# EAGLE design Part_Ninja_V1 (EAGLE 5.11)
PROJECT: Part Ninja
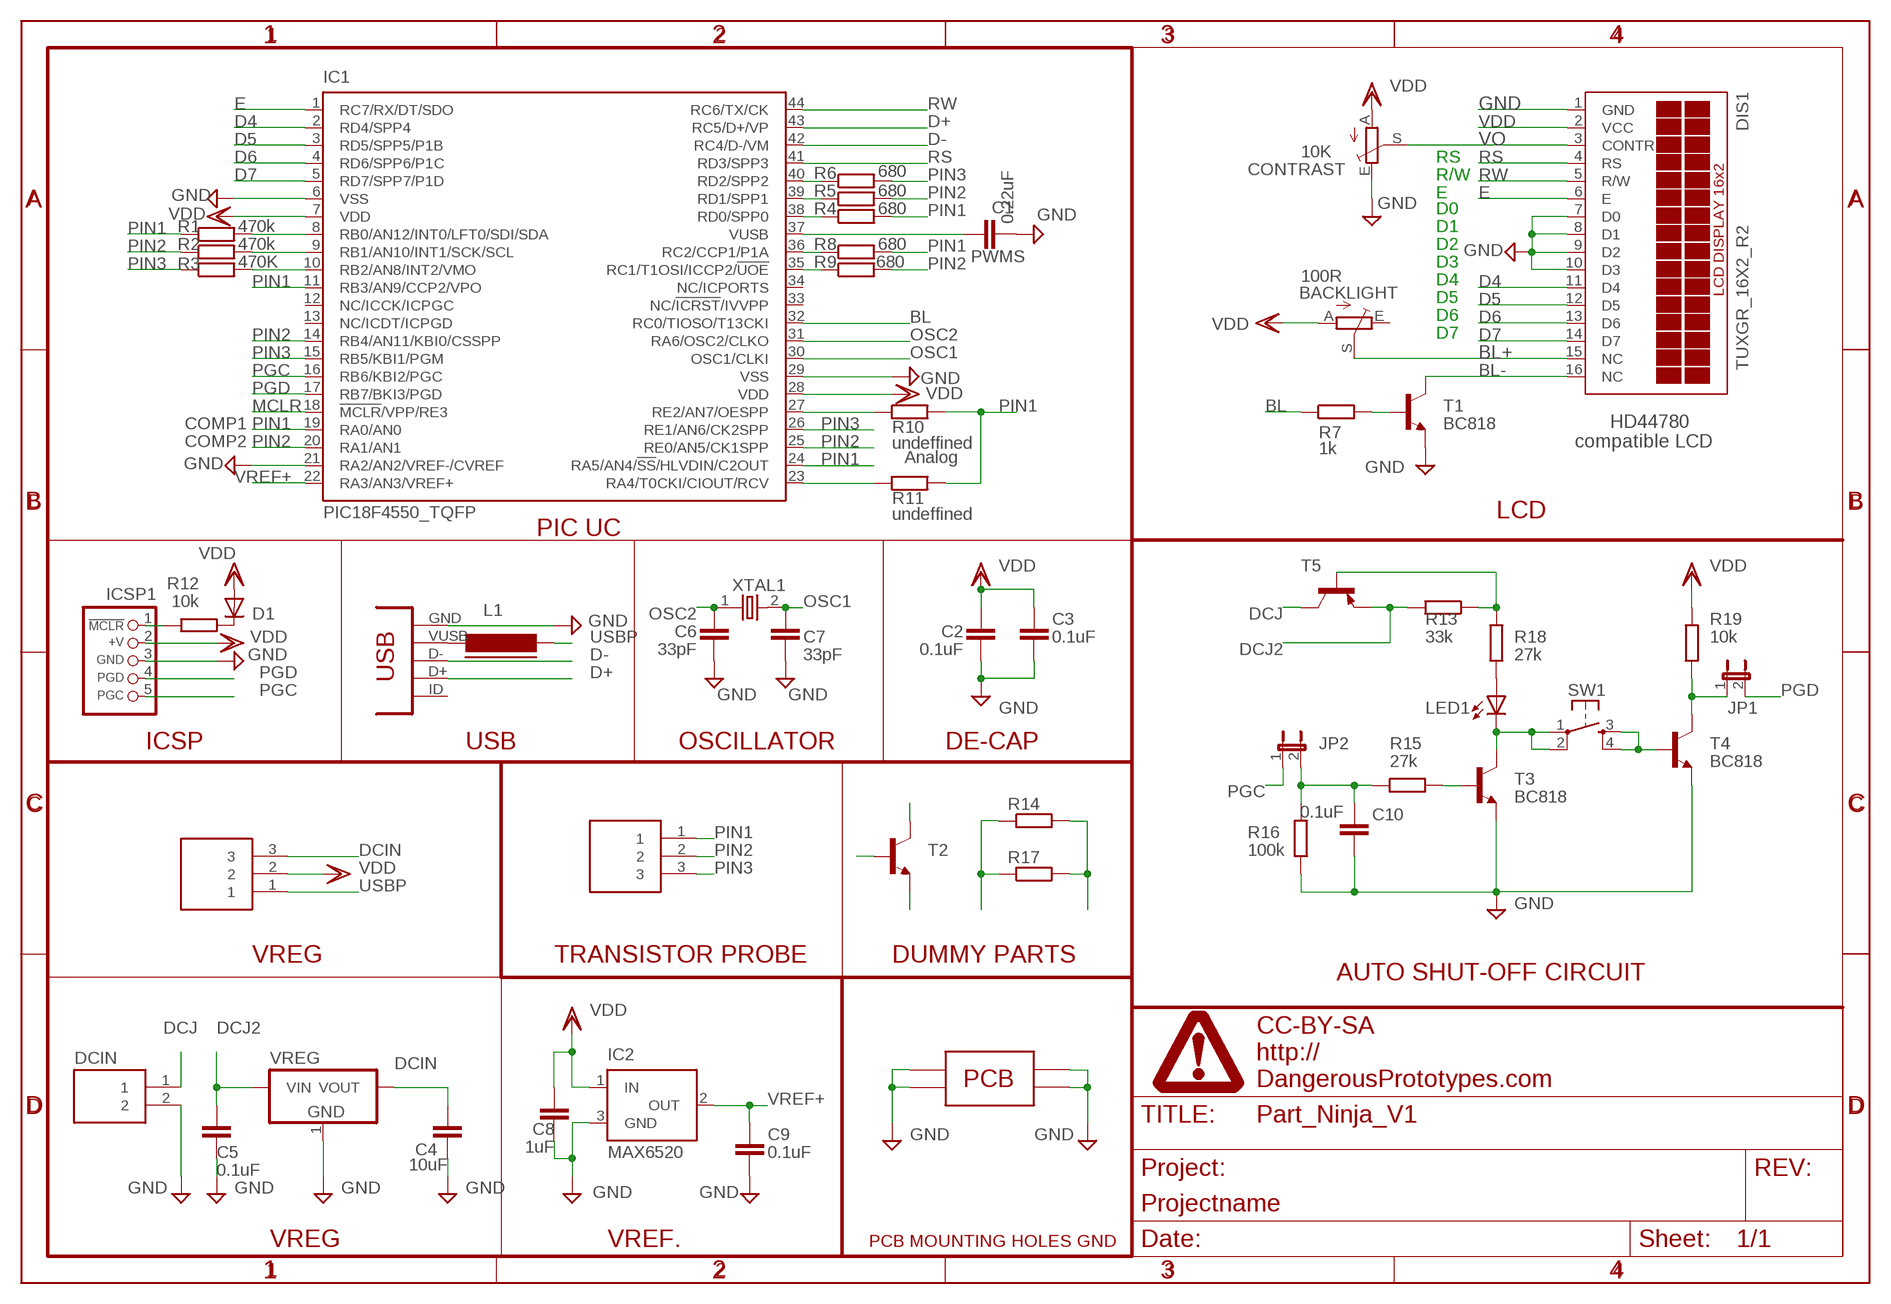
[diagram p0: schematic, sheet 1]

## Parts
BACKLIGHT  100R  TRIM_EU-B25P  [B25P]
C1  0.22uF  CAPC603  [C603]
C2  0.1uF  CAPC603  [C603]
C3  0.1uF  CAPC603  [C603]
C4  10uF  CAPC603  [C603]
C5  0.1uF  CAPC603  [C603]
C6  33pF  CAPC603  [C603]
C7  33pF  CAPC603  [C603]
C8  1uF  CAPC603  [C603]
C9  0.1uF  CAPC603  [C603]
C10  0.1uF  CAPC603  [C603]
CONTRAST  10K  TRIM_EU-B25P  [B25P]
D1  D-SOD123  [SOD123]
DCIN  HEADER1X2PTH  [M1X2]
DIS1  TUXGR_16X2_R2  [TUXGR_16X2_R2]
IC1  PIC18F4550_TQFP  [TQFP44]
IC2  MAX6520  [SOT23]
ICSP1  HEADER_PRG_PIC_ICSPB  [HEADER_PRG_1X05_ICSP_B]
JP1  JP1E  [JP1]
JP2  JP1E  [JP1]
L1  FERRITE_BEAD603  [FB603]
LED1  LED805  [LED-805]
PROBES  HEADER1X3PTH  [M1X3]
PWR  HEADER1X3PTH  [M1X3]
R1  470k  RESISTORR603  [R603]
R2  470k  RESISTORR603  [R603]
R3  470K  RESISTORR603  [R603]
R4  680  RESISTORR603  [R603]
R5  680  RESISTORR603  [R603]
R6  680  RESISTORR603  [R603]
R7  1k  RESISTORR603  [R603]
R8  680  RESISTORR603  [R603]
R9  680  RESISTORR603  [R603]
R10  undeffined  RESISTORR603  [R603]
R11  undeffined  RESISTORR603  [R603]
R12  10k  RESISTORR603  [R603]
R13  33k  RESISTORR603  [R603]
R14  RESISTORR1206  [R1206]
R15  27k  RESISTORR603  [R603]
R16  100k  RESISTORR603  [R603]
R17  RESISTORR603  [R603]
R18  27k  RESISTORR603  [R603]
R19  10k  RESISTORR603  [R603]
SW1  SW-SMD-SMALL  [TACT_SWITCH_SMALL]
T1  BC818  NPNSOT23BEC  [SOT23-BEC]
T2  BC818  NPNSOT23BEC  [SOT23-BEC]
T3  BC818  NPNSOT23BEC  [SOT23-BEC]
T4  BC818  NPNSOT23BEC  [SOT23-BEC]
T5  BJT-PNPSOT23BEC  [SOT23-BEC]
U$1  DINA4_L  [DP_LOGO]
U$2  PCB_STANDARD4.9X8  [PCB4.9X8]
USB1  CON-USB-MINI-BUSB1  [CONN_USB_MINI-B]
VREG  LD1117-3.3SOT223  [SOT223]
XTAL1  OSC-XTAL  [HC-49U]

## Nets
BL: IC1.32(RC0/TIOSO/T13CKI) R7.1
BL+: BACKLIGHT.S DIS1.15(NC)
BL-: DIS1.16(NC) T1.C
D4: DIS1.11(D4) IC1.2(RD4/SPP4)
D5: DIS1.12(D5) IC1.3(RD5/SPP5/P1B)
D6: DIS1.13(D6) IC1.4(RD6/SPP6/P1C)
D7: DIS1.14(D7) IC1.5(RD7/SPP7/P1D)
D+: IC1.43(RC5/D+/VP) USB1.D+
D-: IC1.42(RC4/D-/VM) USB1.D-
DCIN: C4.2 PWR.3 VREG.2(VOUT)
DCJ: DCIN.1 T5.C
DCJ2: C5.2 R13.2 T5.E VREG.3(VIN)
E: DIS1.6(E) IC1.1(RC7/RX/DT/SDO)
GND: C1.2 C2.1 C3.1 C4.1 C5.1 C6.1 C7.1 C8.1 C9.1 C10.1 CONTRAST.E DCIN.2 DIS1.1(GND) DIS1.7(D0) DIS1.8(D1) DIS1.9(D2) DIS1.10(D3) IC1.6(VSS) IC1.21(RA2/AN2/VREF-/CVREF) IC1.29(VSS) IC2.3(GND) ICSP1.3(GND) R16.1 T1.E T3.E T4.E U$2.P$1 U$2.P$2 U$2.P$3 U$2.P$4 USB1.GND VREG.1(GND)
MCLR: IC1.18(!MCLR!/VPP/RE3) ICSP1.1(/MCLR) R12.1
N$1: R7.2 T1.B
N$2: IC1.8(RB0/AN12/INT0/LFT0/SDI/SDA) R1.2
N$3: IC1.9(RB1/AN10/INT1/SCK/SCL) R2.2
N$4: IC1.10(RB2/AN8/INT2/VMO) R3.2
N$5: IC1.38(RD0/SPP0) R4.1
N$6: IC1.39(RD1/SPP1) R5.1
N$7: IC1.40(RD2/SPP2) R6.1
N$8: IC1.27(RE2/AN7/OESPP) R10.1
N$9: LED1.A R18.1
N$10: C1.1 IC1.37(VUSB)
N$11: IC1.23(RA4/T0CKI/CIOUT/RCV) R11.1
N$12: IC1.36(RC2/CCP1/P1A) R8.1
N$13: IC1.35(RC1/T1OSI/ICCP2/!UOE) R9.1
N$14: D1.1(C) R12.2
N$16: SW1.3 SW1.4 T4.B
N$17: R13.1 R18.2 T5.B
N$18: LED1.C SW1.1 SW1.2 T3.C
N$19: R15.2 T3.B
N$21: JP1.1 R19.1 T4.C
N$22: C10.2 JP2.2 R15.1 R16.2
N$23: L1.1 USB1.VUSB
OSC1: C7.2 IC1.30(OSC1/CLKI) XTAL1.2
OSC2: C6.2 IC1.31(RA6/OSC2/CLKO) XTAL1.1
PGC: IC1.16(RB6/KBI2/PGC) ICSP1.5(PGC) JP2.1
PGD: IC1.17(RB7/BKI3/PGD) ICSP1.4(PGD) JP1.2
PIN1: IC1.11(RB3/AN9/CCP2/VPO) IC1.19(RA0/AN0) IC1.24(RA5/AN4/!SS!/HLVDIN/C2OUT) PROBES.1 R1.1 R4.2 R8.2 R10.2 R11.2 R14.1 R17.1 T2.C
PIN2: IC1.14(RB4/AN11/KBI0/CSSPP) IC1.20(RA1/AN1) IC1.25(RE0/AN5/CK1SPP) PROBES.2 R2.1 R5.2 R9.2 R14.2 R17.2 T2.B
PIN3: IC1.15(RB5/KBI1/PGM) IC1.26(RE1/AN6/CK2SPP) PROBES.3 R3.1 R6.2 T2.E
RS: DIS1.4(RS) IC1.41(RD3/SPP3)
RW: DIS1.5(R/W) IC1.44(RC6/TX/CK)
USBP: L1.2 PWR.1
VDD: BACKLIGHT.A C2.2 C3.2 C8.2 CONTRAST.A D1.2(A) DIS1.2(VCC) IC1.7(VDD) IC1.28(VDD) IC2.1(IN) ICSP1.2(+V) PWR.2 R19.2
VO: CONTRAST.S DIS1.3(CONTR)
VREF+: C9.2 IC1.22(RA3/AN3/VREF+) IC2.2(OUT)
Unconnected: BACKLIGHT.E IC1.12(NC/ICCK/ICPGC) IC1.13(NC/ICDT/ICPGD) IC1.33(NC/!ICRST!/IVVPP) IC1.34(NC/ICPORTS) USB1.BODY@1(BODY) USB1.BODY@2(BODY) USB1.BODY@3(BODY) USB1.BODY@4(BODY) USB1.ID(USBID)

## Notes on the sheet
- RS
- R/W
- E
- D0
- D1
- PWMS | D2
- D3
- D4
- D5
- D6
- D7
- COMP1 | HD44780
- COMP2 | compatible LCD
- Analog
- LCD
- PIC UC
- ICSP | USB | OSCILLATOR | DE-CAP
- VREG | TRANSISTOR PROBE | DUMMY PARTS
- AUTO SHUT-OFF CIRCUIT
- VREG | VREF. | PCB MOUNTING HOLES GND

## Library data of the parts
BACKLIGHT CONTRAST = pot:TRIM_EU-: POTENTIOMETER
C1-C10 = dp_devices:CAP
D1 = semicon-smd-ipc:D-: DIODE unfilled
DCIN = dp_devices:HEADER1X2
DIS1 = display-lcd:TUXGR_16X2_R2: Tuxgraphics LCD display 16x2 characters reflective, without background light Source: tuxgr_12x2_r2.pdf; OC_FARNELL: unknown; OC_NEWARK: unknown
IC1 = microchip:PIC18F4*_TQFP: USB Microcontrollers with nanoWatt Technology High-Performance, Enhanced Flash, 28/40/44-Pin, Source: http://ww1.microchip.com/downloads/en/devicedoc/39632c.pdf; MF: MICROCHIP; MPN: PIC18F4550-I/PT; OC_FARNELL: 9321365; OC_NEWARK: 08J9633
IC2 = maxim:MAX6520: 1.2V Voltage Reference 50ppm/°C, SOT23, 3-Terminal Source: http://datasheets.maxim-ic.com/en/ds/MAX6520.pdf; MF: MAXIM; MPN: MAX6520EUR-T; OC_FARNELL: unknown; OC_NEWARK: 02J4586
ICSP1 = dp_devices:HEADER_PRG_PIC_ICSP: 5-pin PIC In Circuit Serial Programming header
JP1 JP2 = jumper:JP1E: JUMPER
L1 = dp_devices:FERRITE_BEAD
LED1 = DP2:LED
PROBES = DP2:HEADER1X3
PWR = dp_devices:HEADER1X3
R1-R13 R15 R16 R18 R19 = dp_devices:RESISTOR
R14 R17 = fifo:RESISTOR
SW1 = dp_devices:SW-SMD-SMALL
T1-T4 = dp_devices:NPN: Most commonly used is SOT23-BEC
T5 = DP2:BJT-PNP: Most commonly used is SOT23-BEC
U$1 = DP2:DINA4_L: A4 DP frame Standard Dangerous Prototypes schematic frame. Automagically adds the DP logo and standard texts to the PCB Use the atrribute in the schematic editor to change the fields.; FF1: fulfillment by; FF2: Seeed Studio; FF3: www.seeedstudio.com; LICENSE: CC-BY-SA; PROJECT: Projectname; URL1: http://; URL2: DangerousPrototypes.com
U$2 = DP2:PCB_STANDARD
USB1 = dp_devices:CON-USB-MINI-B: USB connector
VREG = dp_devices:LD1117-3.3
XTAL1 = dp_devices:OSC-XTAL

## Board
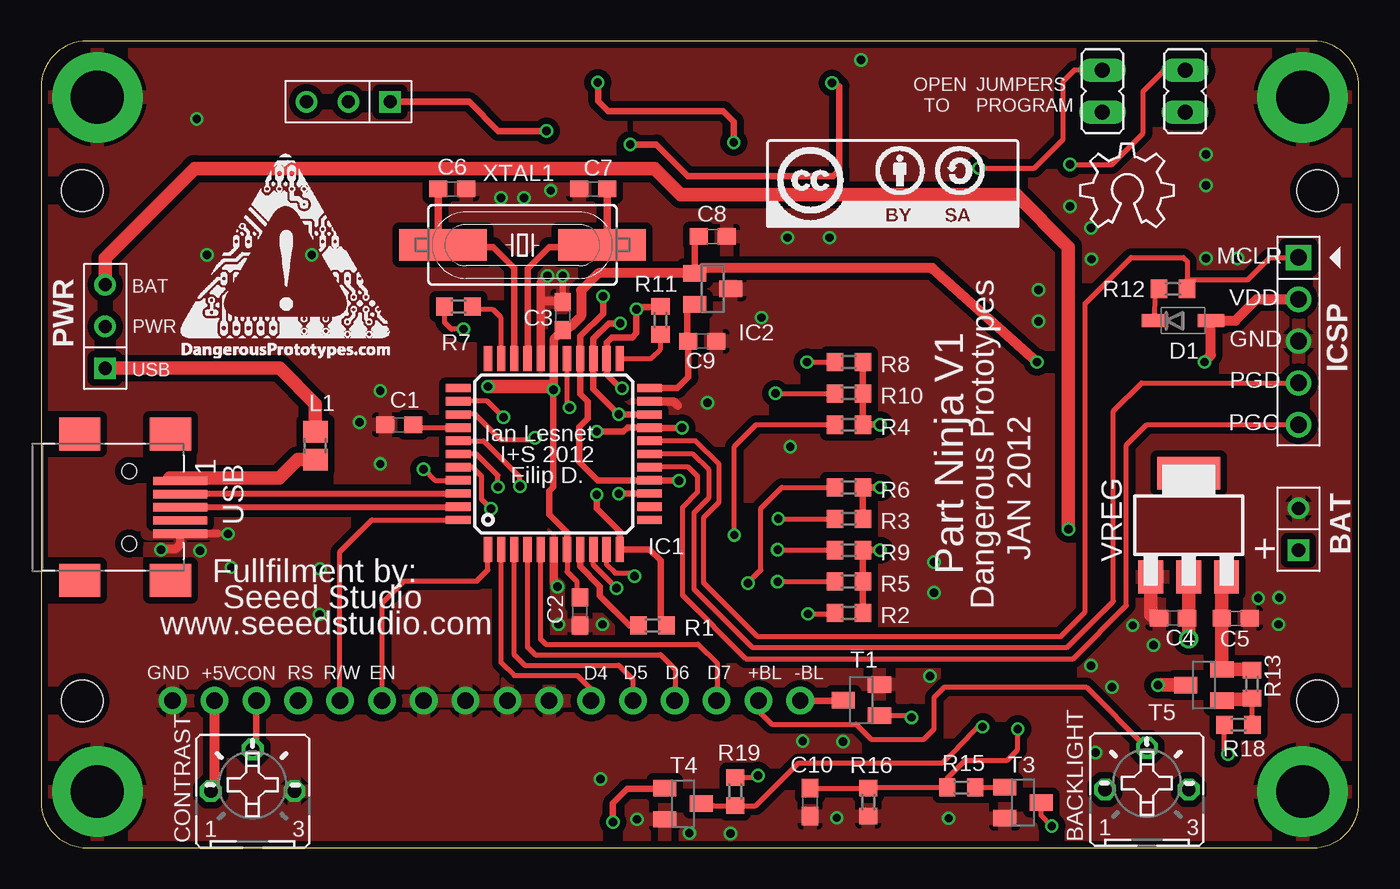
[diagram p1: board, top side]
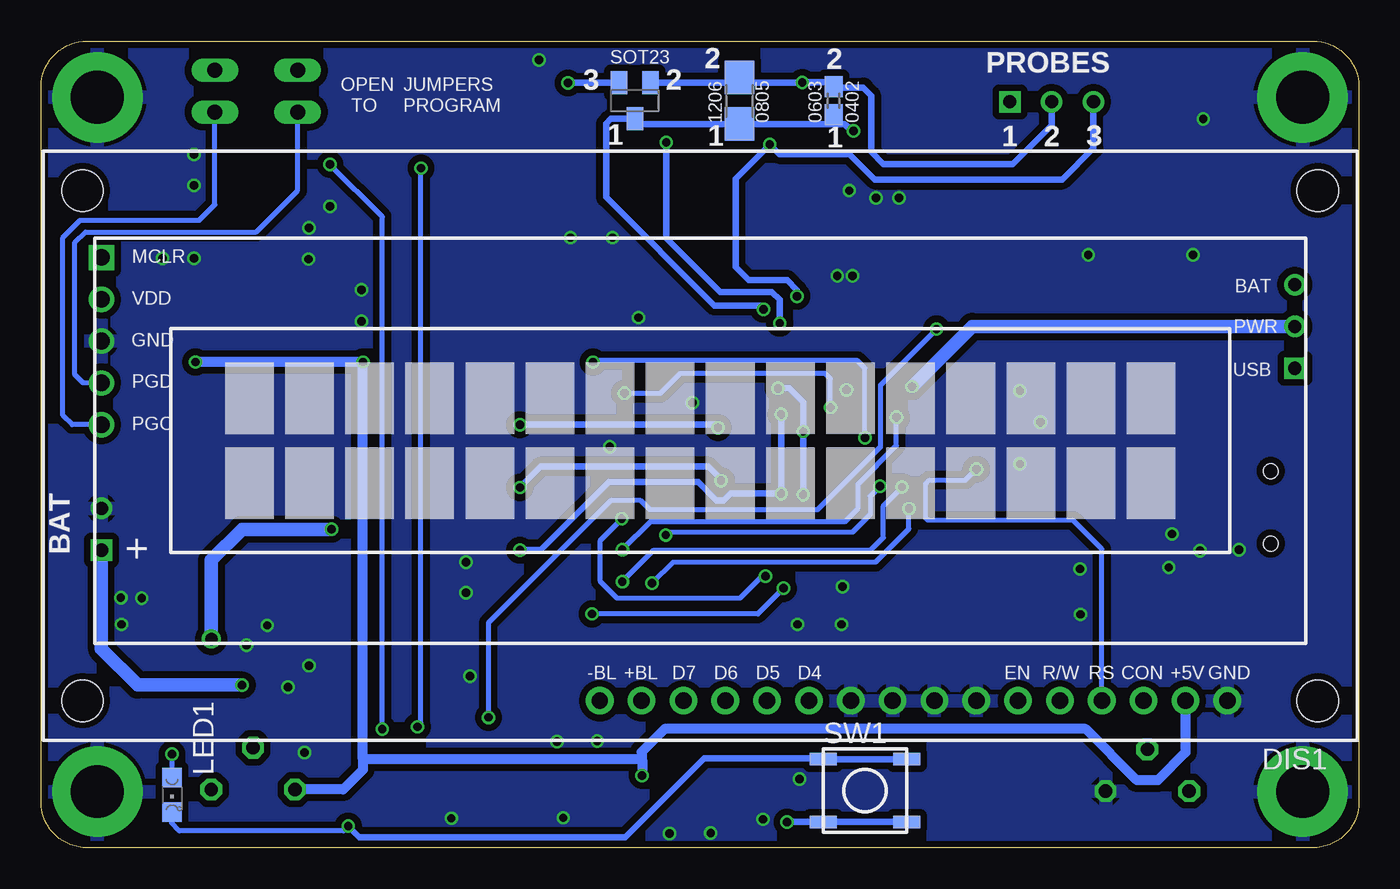
[diagram p2: board, bottom side, seen from below]

Size 80 x 49 mm. Coordinates in mm from the lower left corner, seen from the top.
Copper layers (1*16): Top 0.035mm / dielectric 1.5mm / Bottom 0.035mm
Design rules "Fusion_eagle_rule_v1.1": minimum track width 6mil, minimum drill 12mil, track to track 6mil, track to pad 6mil, pad to pad 6mil, via to via 6mil, smd to smd 0mil, copper to edge 10mil, drill to drill 10mil, minimum pad ring 10mil, minimum via ring 6mil, stop-mask expansion 2mil, vias tented up to drill 100mil, thermal gap 10mil

### Footprints (pad centres in the part's own frame; a part is rotated, then mirrored left to right if it is on the bottom)
B25P = drill 0.813 octagon: A -2.54,0; E 2.54,0; S 0,2.54
C603 = smd 1.1 x 1: 1 -0.85,0; 2 0.85,0
SOD123 = smd 1.6 x 0.8: 1 -1.7,0; 2 1.7,0
M1X2 = drill 0.8 square: 1 -1.27,0 | drill 0.8 round: 2 1.27,0
TUXGR_16X2_R2 = drill 1 pad 1.676 round: 1 -32,15.5; 2 -29.46,15.5; 3 -26.92,15.5; 4 -24.38,15.5; 5 -21.84,15.5; 6 -19.3,15.5; 7 -16.76,15.5; 8 -14.22,15.5; 9 -11.68,15.5; 10 -9.14,15.5; 11 -6.6,15.5; 12 -4.06,15.5; 13 -1.52,15.5; 14 1.02,15.5; 15 3.56,15.5; 16 6.1,15.5 | hole 2.5: -37.5,-15.5; 37.5,-15.5; -37.5,15.5; 37.5,15.5
TQFP44 = smd 1.5 x 0.5: 1 -5.8,4; 2 -5.8,3.2; 3 -5.8,2.4; 4 -5.8,1.6; 5 -5.8,0.8; 6 -5.8,0; 7 -5.8,-0.8; 8 -5.8,-1.6; 9 -5.8,-2.4; 10 -5.8,-3.2; 11 -5.8,-4; 23 5.8,-4; 24 5.8,-3.2; 25 5.8,-2.4; 26 5.8,-1.6; 27 5.8,-0.8; 28 5.8,0; 29 5.8,0.8; 30 5.8,1.6; 31 5.8,2.4; 32 5.8,3.2; 33 5.8,4 | smd 0.5 x 1.5: 12 -4,-5.8; 13 -3.2,-5.8; 14 -2.4,-5.8; 15 -1.6,-5.8; 16 -0.8,-5.8; 17 0,-5.8; 18 0.8,-5.8; 19 1.6,-5.8; 20 2.4,-5.8; 21 3.2,-5.8; 22 4,-5.8; 34 4,5.8; 35 3.2,5.8; 36 2.4,5.8; 37 1.6,5.8; 38 0.8,5.8; 39 0,5.8; 40 -0.8,5.8; 41 -1.6,5.8; 42 -2.4,5.8; 43 -3.2,5.8; 44 -4,5.8
SOT23 = smd 1 x 1.4: 1 -0.95,-1.1; 2 0.95,-1.1; 3 0,1.1
HEADER_PRG_1X05_ICSP_B = drill 1.016 square: 1 -5.08,0 | drill 1.016 round: 2 -2.54,0; 3 0,0; 4 2.54,0; 5 5.08,0
JP1 = drill 0.914 long: 1 0,-1.27; 2 0,1.27
FB603 = smd 1.3 x 1.5: 1 -0.85,0; 2 0.85,0
LED-805 = smd 1.2 x 1.2: A 0,-1.05; C 0,1.05
M1X3 = drill 0.8 square: 1 0,0 | drill 0.8 round: 2 2.54,0; 3 5.08,0
R603 = smd 1 x 1.1: 1 -0.85,0; 2 0.85,0
R1206 = smd 2.032 x 1.803: 1 -1.422,0; 2 1.422,0
R603' = smd 1.27 x 1.1: 1 -0.85,0; 2 0.85,0
TACT_SWITCH_SMALL = smd 1.651 x 0.762: 1 -2.54,1.905; 2 2.54,1.905; 3 -2.54,-1.905; 4 2.54,-1.905
SOT23-BEC@1 = smd 1 x 1.4: B -0.95,-1.1; C 0,1.1; E 0.95,-1.1
SOT23-BEC = smd 1 x 1.4: B -0.95,-1.1; C 0,1.1; E 0.95,-1.1
PCB4.9X8 = drill 3.2 pad 5.5 round: P$1 76.99,3.81; P$2 3.81,3.81; P$3 3.81,45.99; P$4 76.99,45.99
CONN_USB_MINI-B = smd 2 x 2.5: BODY@1 -4.45,2.5; BODY@2 4.45,2.5; BODY@3 4.45,-3; BODY@4 -4.45,-3 | smd 0.5 x 3.3: D+ 0,3.1; D- -0.8,3.1; GND 1.6,3.1; ID 0.8,3.1; VUSB -1.6,3.1 | hole 0.9: -2.2,0; 2.2,0
SOT223 = smd 1.5 x 2: 1 -2.3,-3.15; 2 0,-3.15; 3 2.3,-3.15 | smd 3.8 x 2: 4 0,3.15
HC-49U = smd 5.334 x 1.93: 1 -4.826,0; 2 4.826,0

### Placement (x,y rotation side)
BACKLIGHT  67.13,3.54 0 top
C1  [C603]  21.73,25.7 180 top
C2  32.72,14.36 90 top
C3  31.67,32.3 270 top
C4  0.1uF  [C603]  68.72,13.95 0 top
C5  10uF  [C603]  72.53,13.95 180 top
C6  24.97,40.02 180 top
C7  33.51,40.02 0 top
C8  40.78,37.13 180 top
C9  40.14,30.78 180 top
C10  [C603]  46.69,2.77 90 top
CONTRAST  12.84,3.44 0 top
D1  69.32,32.02 0 top
DCIN  76.34,19.35 90 top
DIS1  39.99,24.43 180 bottom
IC1  31.13,23.92 90 top
IC2  40.78,33.95 270 top
ICSP1  76.34,30.78 270 top
JP1  64.43,45.95 180 top
JP2  69.45,45.95 0 top
L1  16.65,24.43 90 top
LED1  72.05,3.22 180 bottom
PROBES  21.19,45.32 180 top
PWR  3.89,29.13 90 top
R1  37.13,13.51 180 top
R2  49.03,14.27 180 top
R3  49.03,19.98 180 top
R4  49.03,25.7 0 top
R5  49.03,16.17 0 top
R6  49.03,21.89 0 top
R7  680  [R603]  25.35,32.87 180 top
R8  49.03,29.51 0 top
R9  49.03,18.08 0 top
R10  680  [R603]  49.03,27.6 0 top
R11  680  [R603]  37.6,32.05 90 top
R12  680  [R603]  68.72,33.95 180 top
R13  470K  [R603]  73.51,9.95 90 top
R14  37.6,45.38 90 bottom
R15  470K  [R603]  55.86,3.66 0 top
R16  470K  [R603]  50.21,2.77 90 top
R17  [R603']  31.89,45.38 90 bottom
R18  470K  [R603]  72.69,7.47 0 top
R19  470K  [R603]  42.15,3.41 90 top
SW1  29.98,3.47 0 bottom
T1  BC818  [SOT23-BEC@1]  49.8,8.97 90 top
T2  43.95,45.38 180 bottom
T3  59.61,2.74 270 top
T4  38.97,2.68 270 top
T5  70.59,9.89 90 top
U$1  1.5,-5.48 0 top  (outside the outline)
U$2  -0.4,-0.4 0 top
U$3  [DP_LOGO_ART_0.5X0.5]  8.49,29.76 0 top
U$4  [CC-BY-SA]  44.05,37.7 0 top
U$6  [OSHW_6X200_NOTEXT]  63.1,37.7 0 top
USB1  5.35,20.68 270 top
VREG  69.67,19.6 0 top
XTAL1  29.22,36.62 0 top

### Tracks (layer width: path | path; a pad name or v marks a point on that pad's centre or on a via)
BL
  Top 0.305: IC1.32 27.93,32.2 27.45,32.68 26.39,32.68 R7.1
BL+
  Top 0.305: BACKLIGHT.S 63.45,9.76 54.84,9.76 54.21,9.12 54.21,7.22 53.58,6.58 50.4,6.58 49.48,7.51 44.37,7.51 43.55,8.33
  Top 0.406: DIS1.15 43.55,8.33 | BACKLIGHT.S 67.07,6.01
BL-
  Top 0.406: DIS1.16 48.66,8.93 T1.C
D4
  Top 0.305: IC1.2 27.93,11.25 28.71,10.46 32.56,10.46 33.39,9.63 DIS1.11
D5
  Top 0.305: IC1.3 28.73,11.72 29.35,11.09 35.07,11.09 35.93,10.23 DIS1.12
D6
  Top 0.305: IC1.4 29.53,12.18 29.99,11.73 37.61,11.73 38.49,10.84 38.49,8.96 DIS1.13
D7
  Top 0.305: IC1.5 30.33,12.66 30.62,12.36 39.89,12.36 41.03,11.22 41.03,8.96 DIS1.14
D+
  Top 0.406: USB1.D+ IC1.43
D-
  Top 0.406: USB1.D- IC1.42
DCIN  (via drill 0.51, 0.76)
  Top 0.813: VREG.2 69.67,13.74 C4.2 69.67,13.53 v69.67,12.68 | v62.37,19.35 62.37,36.49 59.2,39.67 38.84,39.67 37.26,41.26 9.31,41.26 3.89,35.83 PWR.3
  Bottom 0.813: v69.67,12.68 69.67,17.47 67.8,19.35 v62.37,19.35
DCJ  (via drill 0.51)
  Top 0.813: v67.8,9.89 T5.C
  Bottom 0.813: v67.8,9.89 74.15,9.89 76.34,12.08 DCIN.1
DCJ2
  Top 0.813: 71.89,16.21 VREG.3 71.68,15.84 C5.2 T5.E 73.48,10.84 R13.2
E
  Top 0.305: IC1.1 27.13,16.87 26.46,16.2 22.05,16.2 20.71,14.87 20.71,8.96 DIS1.6
GND  (via drill 0.51)
  Top 0.406: v31.67,34.75 31.67,34.11 31.67,33.22 C3.1
  Top 0.457: 10.74,19.09 9.7,19.09 9.7,19.06 9.63,19.06 9.61,19.08 USB1.GND
  Top 0.508: IC1.6 31.13,16.08 v31.35,15.86 | IC1.29 30.33,34.33 v30.75,34.75 | IC1.21 38.41,27.12 38.65,26.87 | USB1.GND 8.45,18.42 8.17,18.14 7.31,18.14 v7.28,18.11 | 31.67,33.22 30.33,33.22 30.33,33.25
  Top 0.813: VREG.1 67.37,14.13 C4.1
  other vias: 54.21,15.51 34.08,13.57 31.41,13.57 9.63,18.05 40.46,27.03 29.32,39.48 27.92,39.48 30.94,39.92 20.59,27.76 19.32,25.86 20.59,23.32 45.32,37.06 45.48,24.36 43.73,32.21 47.86,37.06 75.13,13.57 73.89,15.16 75.16,15.19 53.96,10.43 55.1,1.79 48.3,1.82 36.18,1.73 62.47,38.97 60.56,33.89 60.56,31.99 63.74,11.06 65,9.76 66.27,13.51 67.54,12.3 54.21,17.35 64.02,5.79 70.72,42.11 70.72,40.24 72.62,35.79 70.72,35.79 63.74,37.67 63.77,35.76 41.86,0.87 39.35,0.9 33.95,4.17 48.69,6.46 46.24,6.49 16.43,36.02 10.08,36.02 9.44,44.27 49.77,47.86 11.35,19.06 11.54,17.03 16.94,16.94 16.9,14.17
  pour Top (isolate 0.406): -0.5,-0.34 -0.5,49.19 80.15,49.19 80.15,-0.34
  pour Bottom (isolate 0.406): -0.5,-0.34 -0.5,49.19 80.15,49.19 80.15,-0.34
MCLR
  Top 0.305: IC1.18 39.73,24.72 41.16,23.29 41.16,21 40.24,20.08 40.24,16.08 43.48,12.84 61.89,12.84 63.39,14.33 63.39,33.06 66.18,35.86 69.35,35.86 69.57,35.64 69.57,34.52 | 69.57,34.52 R12.1 | 69.57,34.52 73.26,34.52 74.59,35.86 ICSP1.1
N$1  (via drill 0.51)
  Top 0.305: R7.2 24.5,31.91 24.91,31.51 v25.64,31.51 | v52.84,7.92 52.75,8.02 T1.B
  Bottom 0.305: v25.64,31.51 29.03,28.11 29.03,24.36 32.87,20.52 43.03,20.52 43.61,21.09 45.41,21.09 52.84,13.66 v52.84,7.92
N$2
  Top 0.406: IC1.8 32.73,17.08 33.92,15.89 33.92,15.28 35.7,13.51 R1.2
N$3  (via drill 0.51)
  Top 0.305: v46.56,14.2 48.12,14.2 R2.2 | IC1.9 33.53,17.17 v34.94,15.76
  Bottom 0.305: v34.94,15.76 36.49,14.2 v46.56,14.2
N$4  (via drill 0.51)
  Top 0.305: v44.75,19.98 R3.2 | IC1.10 34.33,17.2 34.84,16.68 35.83,16.68 v36.02,16.49
  Top 0.406: R3.2
  Bottom 0.305: v44.75,19.98 46.05,18.68 46.05,16.17 45.03,15.16 37.57,15.16 36.24,16.49 v36.02,16.49
N$5  (via drill 0.51)
  Top 0.305: v42.08,19 42.08,24.36 43.41,25.7 R4.1 | IC1.38 26.87,24.72 29.03,22.55 29.03,21.98 v29.06,21.95
  Bottom 0.305: v42.08,19 41.8,19.16 30.75,19.16 29.67,20.24 29.67,21.35 v29.06,21.95
N$6  (via drill 0.51)
  Top 0.305: R5.1 v44.72,16.17 | IC1.39 26.43,23.92 27.73,22.62 v27.73,21.92
  Bottom 0.305: v44.72,16.17 42.84,18.05 29.67,18.05 28.87,18.84 28.87,20.78 v27.73,21.92
N$7  (via drill 0.51)
  Top 0.305: IC1.40 26.18,23.13 26.75,22.55 26.75,21.16 v27.32,20.59 | v42.91,16.08 43.7,16.87 43.7,20.62 44.97,21.89 R6.1
  Top 0.406: IC1.40
  Bottom 0.305: v42.91,16.08 41.64,17.35 29.35,17.35 27.32,19.38 v27.32,20.59
N$8  (via drill 0.51)
  Top 0.305: v44.59,27.6 R10.1 | IC1.27 31.93,26.72 v32.08,26.75
  Bottom 0.305: v44.59,27.6 42.4,27.6 41.19,28.81 32.4,28.81 32.08,28.49 v32.08,26.75
N$9  (via drill 0.51)
  Top 0.305: R18.1 71.84,5.91 v72.05,5.7
  Bottom 0.305: LED1.A v72.05,5.7
N$10
  Top 0.305: 22.76,25.52 IC1.37
  Top 0.406: C1.1 22.76,25.52
N$11
  Top 0.305: IC1.23 37.02,29.72 37.61,30.3 R11.1
N$12  (via drill 0.51)
  Top 0.305: v46.5,29.51 R8.1 | 25.37,26.36 26.3,26.36 27.86,24.81 29.95,24.81 v29.99,24.9
  Top 0.406: IC1.36 25.37,26.36
  Bottom 0.305: 30.02,24.94 v29.99,24.9 29.99,29.13 30.46,29.6 46.4,29.6 v46.5,29.51
N$13  (via drill 0.51)
  Top 0.305: IC1.35 27.1,27.13 v28.08,26.14 | R9.1 44.75,18.08 v44.72,18.11
  Top 0.406: IC1.35
  Bottom 0.305: v28.08,26.14 28.08,24.43 30.4,22.11 30.4,20.62 31.22,19.79 43.03,19.79 v44.72,18.11
N$14
  Top 0.305: D1.1 67.66,33.74 R12.2
N$16  (via drill 0.51)
  Top 0.406: T4.B 37.81,3.57 35.57,3.57 34.72,2.71 v34.72,1.57
  Bottom 0.406: v34.72,1.57 SW1.3 SW1.4
N$17
  Top 0.305: R13.1 73.51,7.24 R18.2
  Top 0.813: R13.1 73.46,9.1 73.39,9.03 71.79,9.03 T5.B
N$18  (via drill 0.51)
  Top 0.305: T3.C 60.71,1.96 v61.35,1.31
  Bottom 0.305: LED1.C 72.08,1.5 71.61,1.03 61.64,1.03 v61.35,1.31
  Bottom 0.406: SW1.2 SW1.1 32.59,5.44 39.73,5.44 44.53,0.65 60.69,0.65 v61.35,1.31
N$19
  Top 0.305: 58.65,3.69 T3.B 58.48,3.66 R15.2
N$21  (via drill 0.51)
  Top 0.305: T4.C 40.83,2.56 R19.1 43.39,2.56 45.99,5.16 54.72,5.16 55.67,6.11 | 55.67,6.11 | 55.67,6.11 56.91,7.35 v57.16,7.35 | v56.94,41.29 60.31,41.29 62.05,43.03 62.05,46.56 62.75,47.26 64.4,47.26 JP1.1
  Bottom 0.305: v56.94,41.29 56.94,7.57 v57.16,7.35
N$22  (via drill 0.51)
  Top 0.305: C10.2 R16.2 50.25,3.66 R15.1 55.01,4.21 56.12,5.31 58.66,5.31 59.29,5.95 v59.29,7.22 | v62.47,41.51 65,41.51 66.91,43.41 66.91,45.95 68.18,47.22 JP2.2
  Bottom 0.305: v59.29,7.22 59.29,38.33 v62.47,41.51
N$23
  Top 0.406: USB1.VUSB 8.72,22.46
  Top 0.813: L1.1 15.58,23.58 14.46,22.46 8.72,22.46 7.79,22.46
OSC1
  Top 0.406: IC1.30 29.53,35.18 30.84,36.49 33.92,36.49 XTAL1.2
  Top 0.457: C7.2 34.36,36.93 XTAL1.2
OSC2
  Top 0.406: IC1.31 28.73,35.21 27.45,36.49 24.52,36.49 XTAL1.1
  Top 0.457: C6.2 24.12,36.9 XTAL1.1
PGC
  Top 0.305: IC1.16 39.29,23.12 39.86,22.55 39.86,21.6 38.94,20.68 38.94,15.32 42.78,11.47 62.66,11.47 65.89,14.71 65.89,24.46 67.13,25.7 ICSP1.5
  Bottom 0.305: JP2.1 69.45,39.06 70.4,38.11 77.64,38.11 78.69,37.06 78.69,26.27 78.12,25.7 ICSP1.5
PGD
  Top 0.305: IC1.17 39.57,23.92 40.56,22.94 40.56,21.28 39.64,20.36 39.64,15.7 43.16,12.17 62.31,12.17 65.1,14.97 65.1,26.52 66.81,28.24 ICSP1.4
  Bottom 0.305: JP1.2 64.43,39.92 66.94,37.41 77.32,37.41 77.96,36.78 77.96,28.75 77.45,28.24 ICSP1.4
PIN1  (via drill 0.51)
  Top 0.305: 38.88,25.51 38.88,25.54 | v36.14,32.71 36.27,32.84 | 37.61,13.88 R1.1
  Top 0.406: 49.88,25.91 R10.2 R8.2 | 49.88,25.91 R4.2 | 49.88,25.91 49.67,25.7 v50.94,25.7 | v38.91,25.51 38.88,25.51 36.94,25.51 IC1.19 36.91,25.54 35.61,25.54 35.35,25.29 v33.73,25.29 | v33.73,21.44 33.73,20.62 35.13,19.22 IC1.11 36.93,18.12 37.61,17.44 37.61,13.88 | 36.27,32.84 36.91,32.84 R11.2 | v36.14,32.71 36.14,31.25 35.89,31 34.65,31 34.33,30.68 IC1.24 34.33,28.75 35.16,27.92 v35.26,27.92 | v30.68,43.54 27.76,43.54 25.98,45.32 PROBES.1
  Bottom 0.406: v50.94,25.7 39.1,25.7 v38.91,25.51 | v35.26,27.92 34.59,27.92 33.73,27.06 v33.73,25.29 v33.73,21.44 | 31.89,43.96 R14.1 43.63,43.96 T2.C 45.4,44.28 45.7,43.99 45.7,39.51 39.13,32.94 36.37,32.94 v36.14,32.71 | 31.89,43.96 R17.1 31.74,44.68 | v30.68,43.54 31.23,43.96 31.89,43.96
PIN2  (via drill 0.51)
  Top 0.406: IC1.20 36.91,26.33 v35.07,26.33 33.53,27.87 IC1.25 33.53,30.92 34.46,31.86 v35.16,31.86 | IC1.14 35.08,21.52 v35.07,21.51 | R5.2 R2.1 | R5.2 | R5.2 R9.2 v50.94,18.08 | v33.8,46.49 33.83,46.49 33.83,45.35 34.43,44.75 41.41,44.75 42.05,44.11 v42.05,42.84
  Bottom 0.406: v35.07,26.33 v35.07,21.51 38.14,21.51 38.56,21.09 39,21.09 40.11,22.21 45.54,22.21 49.67,18.08 v50.94,18.08 | 37.7,46.48 T2.B | v42.05,42.84 42.05,37.03 38.78,33.76 35.64,33.76 35.16,33.29 35.16,32.49 v35.16,31.86 | PROBES.2 18.65,43.89 21,41.54 28.87,41.54 29.6,42.27 29.6,45.7 30.08,46.18 31.83,46.18 R17.2 32.15,46.49 v33.8,46.49 33.16,46.48 37.7,46.48 | R14.2 37.7,46.81 37.7,46.48
PIN3  (via drill 0.51)
  Top 0.406: R3.1 R6.2 v50.94,21.89 | v38.72,22.3 36.95,22.3 IC1.15 33.8,22.32 32.68,23.43 32.68,25.57 33.19,26.08 33.19,27.09 32.72,27.57 32.72,29.71 IC1.26 | IC1.26 32.75,29.7 | v35.76,42.72 37.35,42.72 39.26,40.81 48.08,40.81 48.46,41.19 48.46,46.27 v48.02,46.46 | IC1.26 32.73,31.08 34.11,32.46 v34.11,33.51 | v34.11,33.51
  Bottom 0.305: v38.72,22.3 38.72,22.36
  Bottom 0.406: v48.02,46.46 44.82,46.48 T2.E | v34.11,33.51 34.11,33.89 34.72,34.49 37.03,34.49 37.83,35.29 37.83,40.65 v35.76,42.72 35.19,42.14 30.94,42.14 29.38,40.59 18.02,40.59 16.11,42.49 PROBES.3 | 38.72,22.36 39.51,23.16 49.67,23.16 v50.94,21.89
RS  (via drill 0.51)
  Top 0.305: IC1.41 23.9,22.32 v23.22,23
  Bottom 0.305: v23.22,23 | v23.22,23 23.89,22.33 26.08,22.33 26.3,22.11 26.3,20.05 26.14,19.89 17.35,19.89 15.6,18.14 DIS1.4
RW
  Top 0.305: IC1.44 20.08,19.92 18.14,17.98 DIS1.5
USBP
  Top 0.813: PWR.1 14.49,29.13 16.65,26.97 L1.2
VDD  (via drill 0.51)
  Top 0.305: IC1.7 31.93,16.77 32.52,16.17 32.52,15.4 C2.2 | IC2.1 39.83,34.9 40.15,35.22 | R19.2 43.65,4.26 v43.51,4.39
  Top 0.406: IC2.1 39.68,36.88 C8.2 | IC1.7 31.93,19.15 30.84,20.24 30.84,21.67 31.1,21.92 v31.1,27.83
  Top 0.508: C3.2 31.13,30.91 IC1.28 31.13,27.86 v31.1,27.83
  Top 0.61: DIS1.2 10.53,3.67 CONTRAST.A | ICSP1.2 73.8,33.32 72.5,32.02 D1.2 71.02,29.94 v70.62,29.51 | IC2.1 33.82,34.9 32.78,33.86 32.78,32.3 32.14,31.67 31.88,31.67 C3.2 | 40.15,35.22 54.12,35.22 v60.47,29.51
  Top 0.813: v27.13,28.02 30.91,28.02 v31.1,27.83
  Bottom 0.406: 43.54,5.38 43.51,5.35
  Bottom 0.61: v70.62,29.51 v60.47,29.51 60.47,5.38 | BACKLIGHT.A 61.67,3.54 60.47,4.74 60.47,5.38 | DIS1.2 10.53,5.79 12.21,4.11 13.47,4.11 16.59,7.22 42.15,7.22 43.54,5.82 43.54,5.38 60.47,5.38 | 43.51,5.35 v43.51,4.39
  Bottom 0.813: PWR.2 23.48,31.67 v27.13,28.02
VO
  Top 0.406: DIS1.3 13.07,6.21 CONTRAST.S
VREF+
  Top 0.406: IC2.2 39.48,33 39.22,32.75 39.22,30.91 C9.2 39.3,28.59 38.62,27.92 IC1.22

### Text on the board
tPlace: Dangerous Prototypes | Part Ninja V1 | JAN 2012 | Ian Lesnet | I+S 2012 | Filip D. | Fullfilment by: | Seeed Studio | www.seeedstudio.com
tNames: OPEN | JUMPERS | TO | PROGRAM | MCLR | BAT | VDD | ICSP | PWR | GND | USB | PGD | PGC | USB | + | BAT | GND | +5V | CON | RS | R/W | EN | D4 | D5 | D6 | D7 | +BL | -BL
bNames: SOT23 | 2 | 2 | 2 | 3 | JUMPERS | OPEN | PROGRAM | TO | 0402 | 0603 | 0805 | 1206 | 3 | 2 | 1 | 1 | 1 | 1 | MCLR | BAT | VDD | PWR | GND | USB | PGD | PGC | + | BAT | GND | +5V | CON | RS | R/W | EN | D4 | D5 | D6 | D7 | +BL | -BL